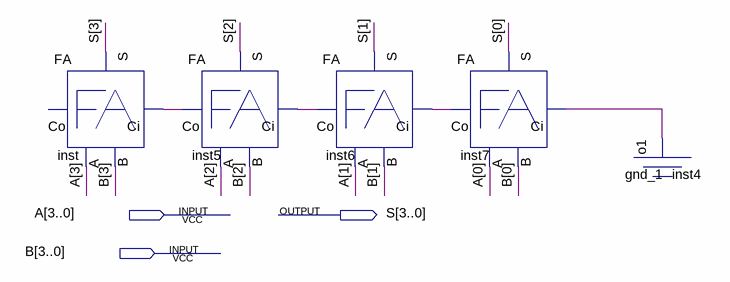
[diagram p0: schematic sheet]
// Quartus schematic FA4.bdf as structural Verilog: 5 symbols, 3 pins
module FA4 (
  input  [3:0] A,
  input  [3:0] B,
  output [3:0] S
);

  wire inst4_o1, inst5_co, inst6_co, inst7_co;

  FA inst (.A(A[3]), .B(B[3]), .Ci(inst5_co), .S(S[3]));  // open: Co
  FA inst5 (.A(A[2]), .B(B[2]), .Ci(inst6_co), .S(S[2]), .Co(inst5_co));
  FA inst6 (.A(A[1]), .B(B[1]), .Ci(inst7_co), .S(S[1]), .Co(inst6_co));
  FA inst7 (.A(A[0]), .B(B[0]), .Ci(inst4_o1), .S(S[0]), .Co(inst7_co));
  gnd_1 inst4 (.o1(inst4_o1));
endmodule
